# EAGLE design baseboard_rev_01 (EAGLE 6.4)

## Sheet 1 of 3
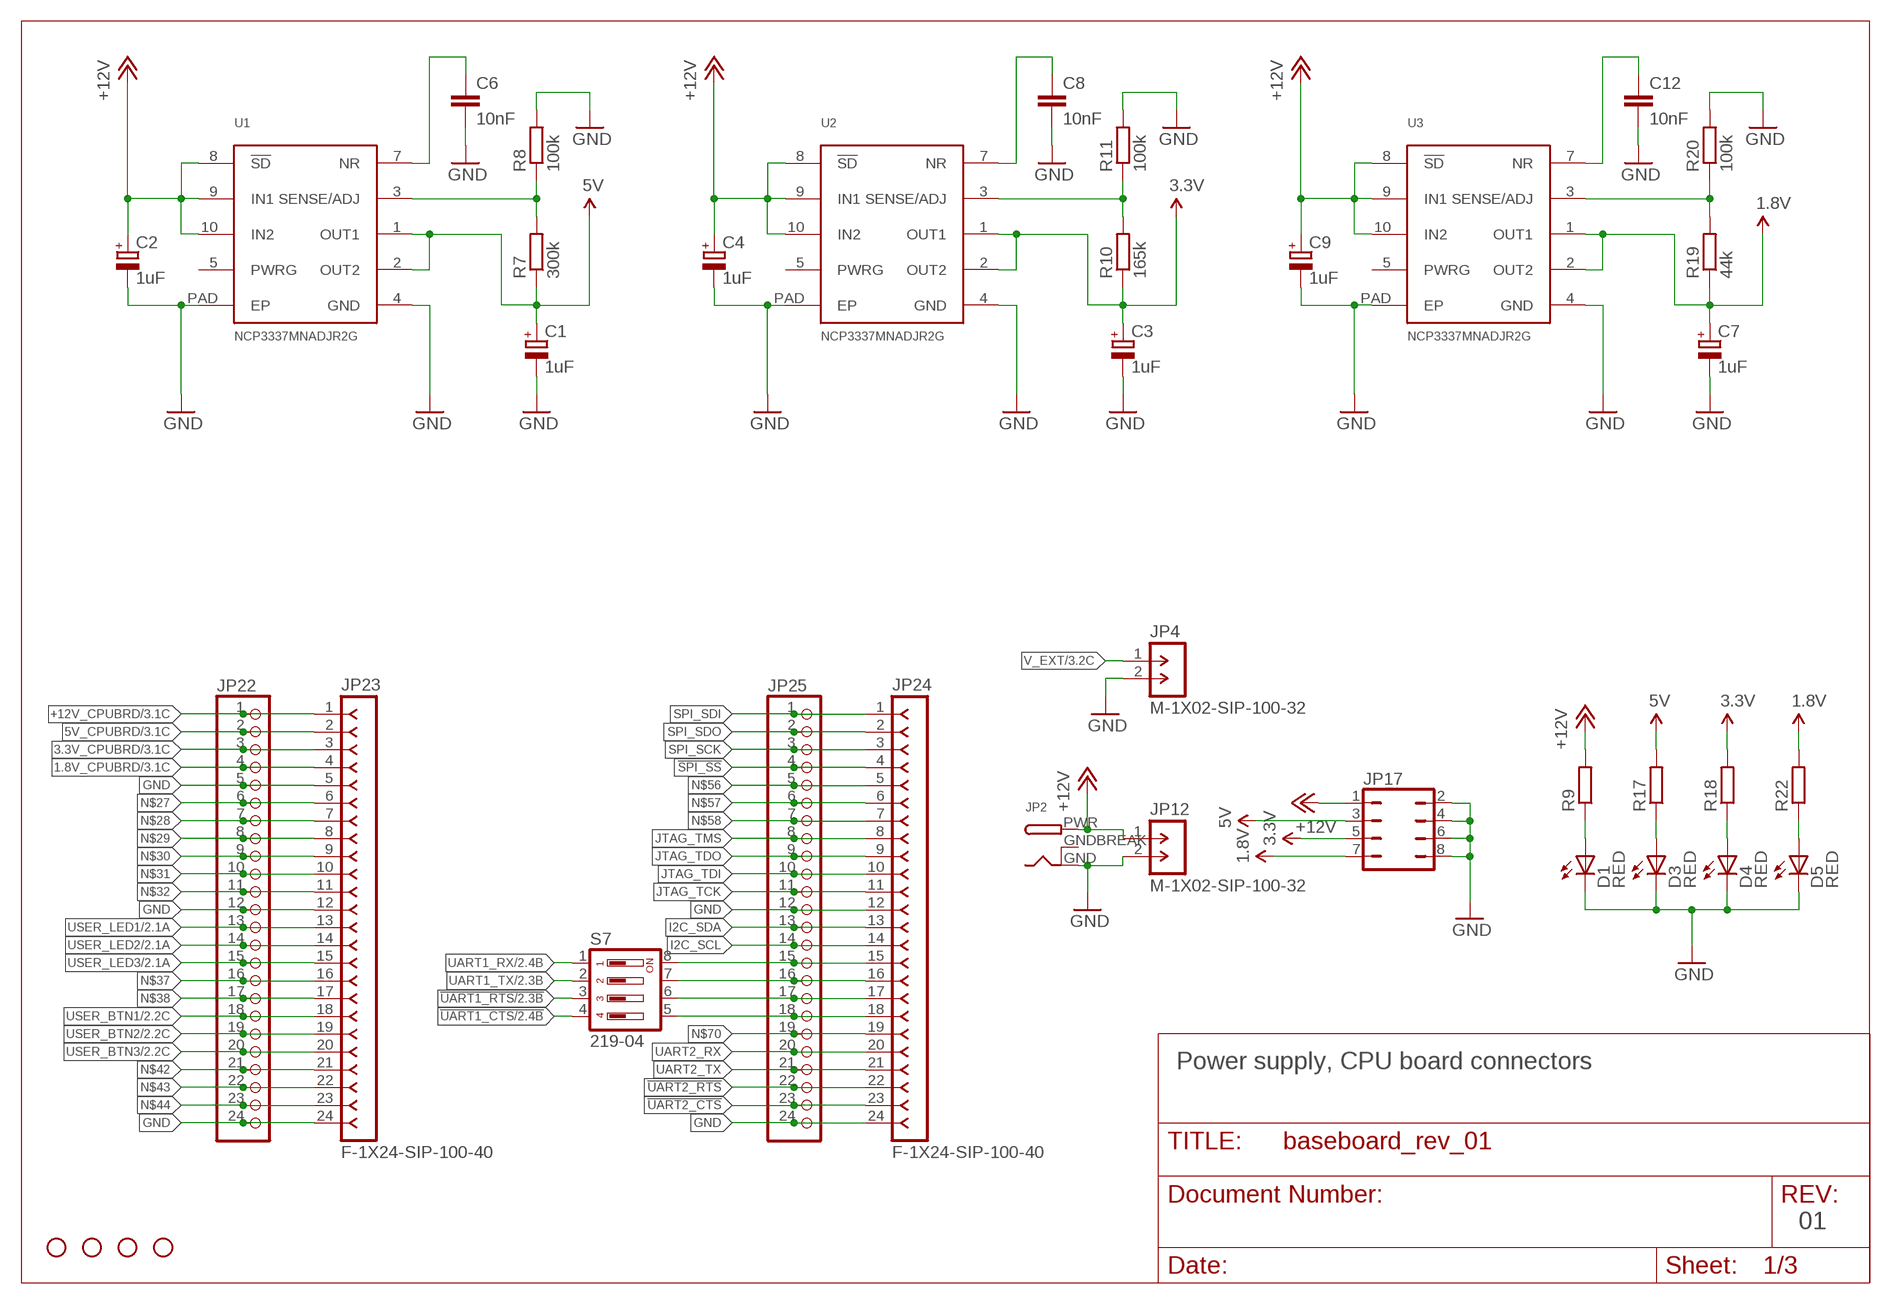
[diagram p0: schematic, sheet 1]

### Parts
C1  1uF  CPOL-EUB  [PANASONIC_B]
C2  1uF  CPOL-EUB  [PANASONIC_B]
C3  1uF  CPOL-EUB  [PANASONIC_B]
C4  1uF  CPOL-EUB  [PANASONIC_B]
C6  10nF  C-EUC0805  [C0805]
C7  1uF  CPOL-EUB  [PANASONIC_B]
C8  10nF  C-EUC0805  [C0805]
C9  1uF  CPOL-EUB  [PANASONIC_B]
C12  10nF  C-EUC0805  [C0805]
D1  RED  LEDCHIPLED_0805  [CHIPLED_0805]
D3  RED  LEDCHIPLED_0805  [CHIPLED_0805]
D4  RED  LEDCHIPLED_0805  [CHIPLED_0805]
D5  RED  LEDCHIPLED_0805  [CHIPLED_0805]
JP1  STAND-OFF  [STAND-OFF]
JP2  DCBARRELPTH  [DCJACK_2MM_PTH]
JP4  M-1X02-SIP-100-32  [SIP-100-02-32]
JP11  STAND-OFF  [STAND-OFF]
JP12  M-1X02-SIP-100-32  [SIP-100-02-32]
JP17  JP4Q  [JP4Q]
JP22  PINHD-1X24  [1X24]
JP23  F-1X24-SIP-100-40  [SIP-100-24-40]
JP24  F-1X24-SIP-100-40  [SIP-100-24-40]
JP25  PINHD-1X24  [1X24]
JP26  STAND-OFF  [STAND-OFF]
JP28  STAND-OFF  [STAND-OFF]
R7  300k  R-EU_R0805  [R0805]
R8  100k  R-EU_R0805  [R0805]
R9  R-EU_R0805  [R0805]
R10  165k  R-EU_R0805  [R0805]
R11  100k  R-EU_R0805  [R0805]
R17  R-EU_R0805  [R0805]
R18  R-EU_R0805  [R0805]
R19  44k  R-EU_R0805  [R0805]
R20  100k  R-EU_R0805  [R0805]
R22  R-EU_R0805  [R0805]
S7  219-04  [CTS-219-04]
U1  NCP3337MNADJR2G  NCP3337  [DFN10]
U2  NCP3337MNADJR2G  NCP3337  [DFN10]
U3  NCP3337MNADJR2G  NCP3337  [DFN10]

### Nets
1.8V: C7.+ JP17.7 R19.1 R22.2 U3.1(OUT1) U3.2(OUT2) ; also sheet 3
1.8V_CPUBRD: JP22.4 JP23.4 ; also sheet 3
3.3V: C3.+ JP17.5 R10.1 R18.2 U2.1(OUT1) U2.2(OUT2) ; also sheet 3
3.3V_CPUBRD: JP22.3 JP23.3 ; also sheet 3
5V: C1.+ JP17.3 R7.1 R17.2 U1.1(OUT1) U1.2(OUT2) ; also sheet 3
5V_CPUBRD: JP22.2 JP23.2 ; also sheet 3
!SPI_SS: JP24.4 JP25.4
!UART1_CTS: S7.4 ; also sheet 2
!UART1_RTS: S7.3 ; also sheet 2
!UART2_CTS: JP24.23 JP25.23
!UART2_RTS: JP24.22 JP25.22
+12V: C2.+ C4.+ C9.+ JP2.PWR JP12.1 JP17.1 R9.2 U1.8(!SD) U1.9(IN1) U1.10(IN2) U2.8(!SD) U2.9(IN1) U2.10(IN2) U3.8(!SD) U3.9(IN1) U3.10(IN2) ; also sheet 2,3
+12V_CPUBRD: JP22.1 JP23.1 ; also sheet 3
GND: C1.- C2.- C3.- C4.- C6.2 C7.- C8.2 C9.- C12.2 D1.C D3.C D4.C D5.C JP2.GND JP4.2 JP12.2 JP17.2 JP17.4 JP17.6 JP17.8 JP22.5 JP22.12 JP22.24 JP23.5 JP23.12 JP23.24 JP24.12 JP24.24 JP25.12 JP25.24 R8.2 R11.2 R20.2 U1.4(GND) U1.PAD(EP) U2.4(GND) U2.PAD(EP) U3.4(GND) U3.PAD(EP) ; also sheet 2,3
I2C_SCL: JP24.14 JP25.14
I2C_SDA: JP24.13 JP25.13
JTAG_TCK: JP24.11 JP25.11
JTAG_TDI: JP24.10 JP25.10
JTAG_TDO: JP24.9 JP25.9
JTAG_TMS: JP24.8 JP25.8
N$11: D4.A R18.1
N$16: D3.A R17.1
N$19: D1.A R9.1
N$24: D5.A R22.1
N$27: JP22.6 JP23.6
N$28: JP22.7 JP23.7
N$29: JP22.8 JP23.8
N$30: JP22.9 JP23.9
N$31: JP22.10 JP23.10
N$32: JP22.11 JP23.11
N$37: JP22.16 JP23.16
N$38: JP22.17 JP23.17
N$42: JP22.21 JP23.21
N$43: JP22.22 JP23.22
N$44: JP22.23 JP23.23
N$51: C8.1 U2.7(NR)
N$56: JP24.5 JP25.5
N$57: JP24.6 JP25.6
N$58: JP24.7 JP25.7
N$66: JP24.15 JP25.15 S7.8
N$67: JP24.16 JP25.16 S7.7
N$68: JP24.17 JP25.17 S7.6
N$69: JP24.18 JP25.18 S7.5
N$70: JP24.19 JP25.19
N$73: R10.2 R11.1 U2.3(SENSE/ADJ)
N$76: C6.1 U1.7(NR)
N$77: R7.2 R8.1 U1.3(SENSE/ADJ)
N$78: C12.1 U3.7(NR)
N$80: R19.2 R20.1 U3.3(SENSE/ADJ)
SPI_SCK: JP24.3 JP25.3
SPI_SDI: JP24.1 JP25.1
SPI_SDO: JP24.2 JP25.2
UART1_RX: S7.1 ; also sheet 2
UART1_TX: S7.2 ; also sheet 2
UART2_RX: JP24.20 JP25.20
UART2_TX: JP24.21 JP25.21
USER_BTN1: JP22.18 JP23.18 ; also sheet 2
USER_BTN2: JP22.19 JP23.19 ; also sheet 2
USER_BTN3: JP22.20 JP23.20 ; also sheet 2
USER_LED1: JP22.13 JP23.13 ; also sheet 2
USER_LED2: JP22.14 JP23.14 ; also sheet 2
USER_LED3: JP22.15 JP23.15 ; also sheet 2
V_EXT: JP4.1 ; also sheet 3
Unconnected: U1.5(PWRG) U2.5(PWRG) U3.5(PWRG)

### Notes on the sheet
- Power supply, CPU board connectors
- 01

## Sheet 2 of 3
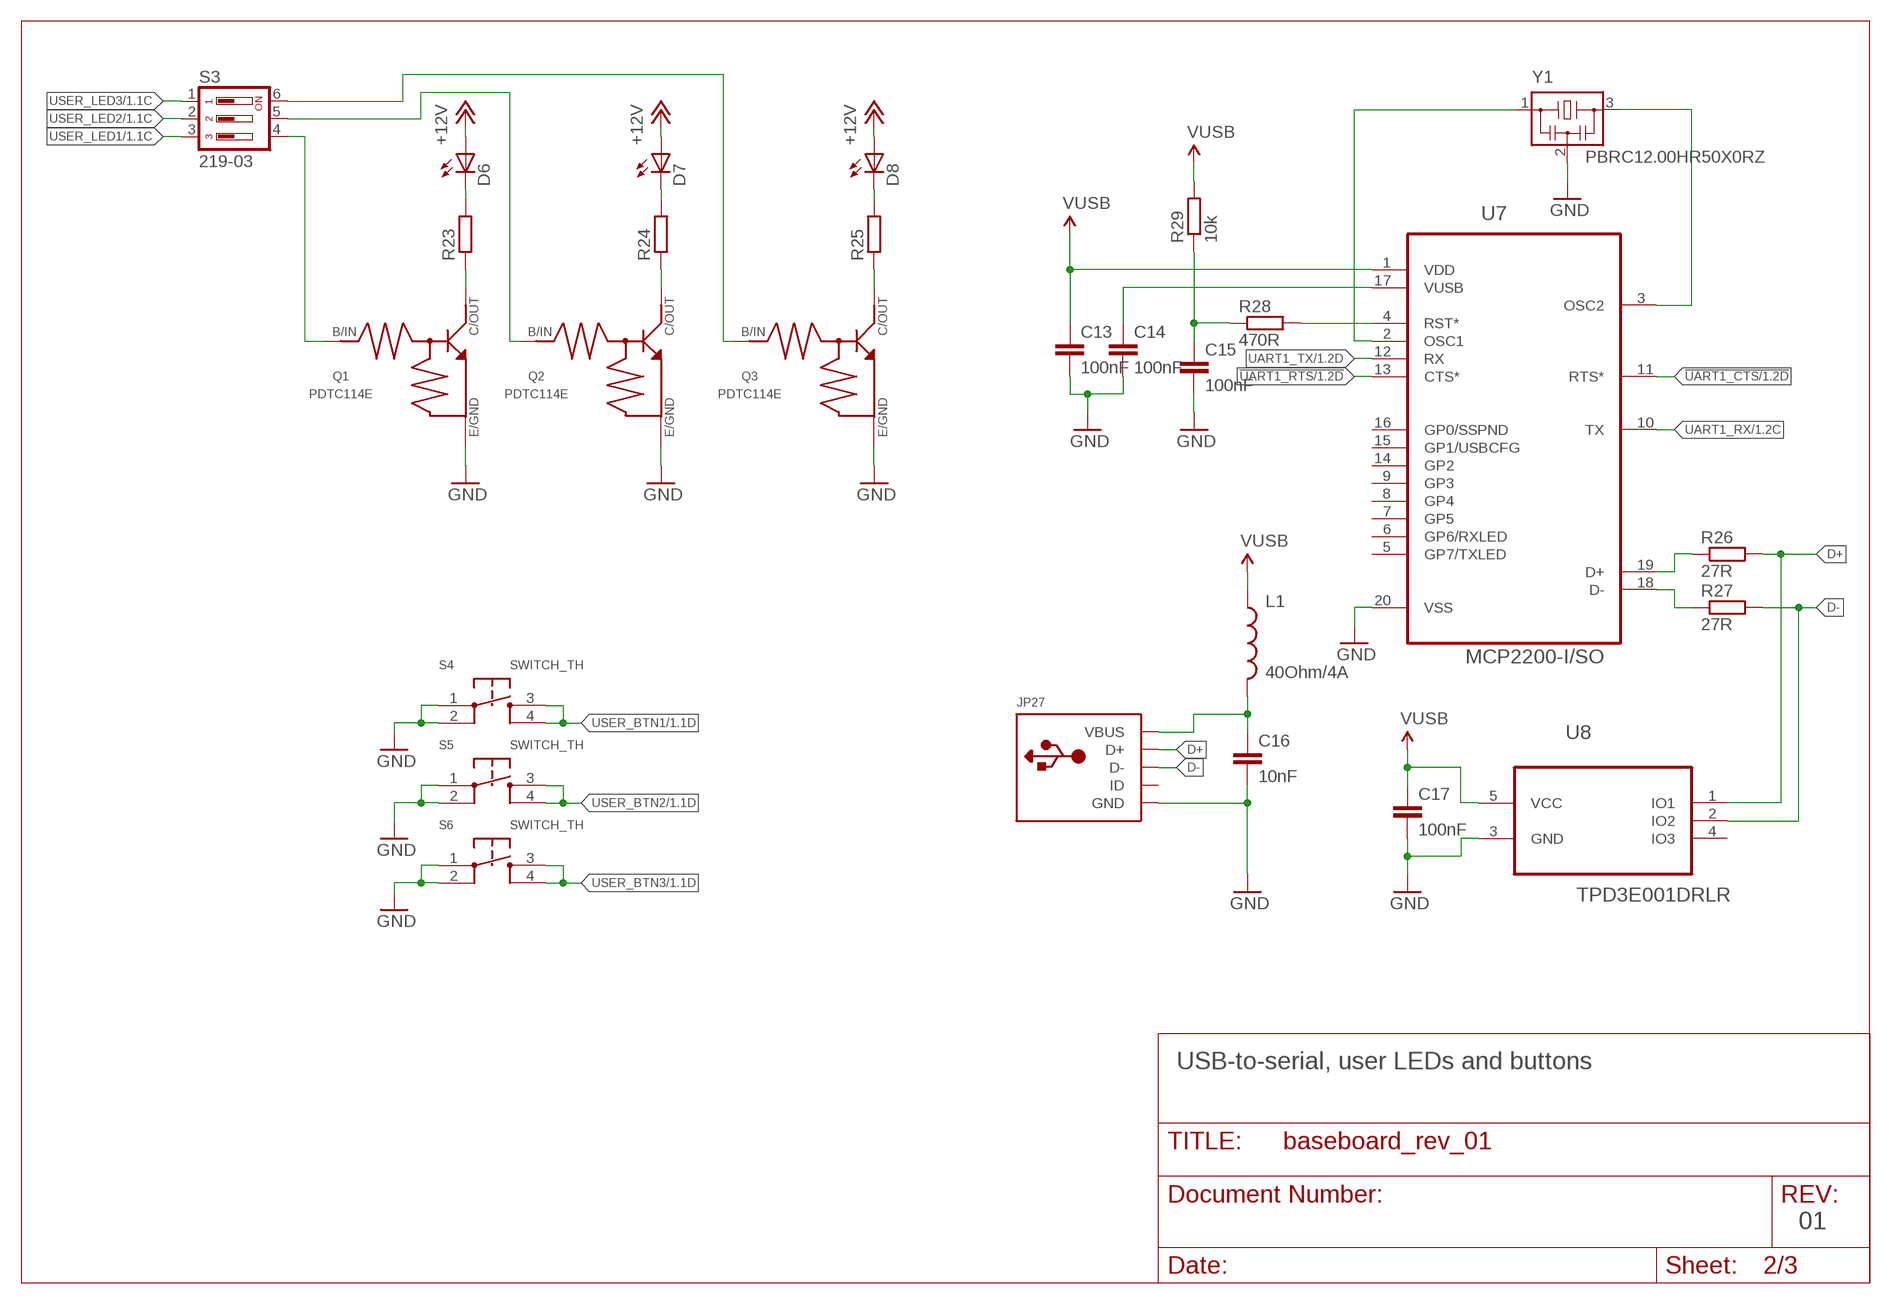
[diagram p1: schematic, sheet 2]

### Parts
C13  100nF  C-EUC0805  [C0805]
C14  100nF  C-EUC0805  [C0805]
C15  100nF  C-EUC0805  [C0805]
C16  10nF  C-EUC0805  [C0805]
C17  100nF  C-EUC0805  [C0805]
D6  LEDCHIPLED_0805  [CHIPLED_0805]
D7  LEDCHIPLED_0805  [CHIPLED_0805]
D8  LEDCHIPLED_0805  [CHIPLED_0805]
JP27  USBMINIB  [USB-MINIB]
L1  40Ohm/4A  INDUCTOR0805  [0805]
Q1  PDTC114E  [SOT416]
Q2  PDTC114E  [SOT416]
Q3  PDTC114E  [SOT416]
R23  R-EU_R0805  [R0805]
R24  R-EU_R0805  [R0805]
R25  R-EU_R0805  [R0805]
R26  27R  R-EU_R0805  [R0805]
R27  27R  R-EU_R0805  [R0805]
R28  470R  R-EU_R0805  [R0805]
R29  10k  R-EU_R0805  [R0805]
S3  219-03  [CTS-219-03]
S4  SWITCH_TH  [SWITCH_TROUGHHOLE]
S5  SWITCH_TH  [SWITCH_TROUGHHOLE]
S6  SWITCH_TH  [SWITCH_TROUGHHOLE]
U7  MCP2200-I/SO  [SOIC127P1034X264-20N]
U8  TPD3E001DRLR  [SOT50P160X60-5N]
Y1  PBRC12.00HR50X0RZ  PBRC-X  [PBRC-H]

### Nets
!UART1_CTS: U7.11(RTS*) ; also sheet 1
!UART1_RTS: U7.13(CTS*) ; also sheet 1
+12V: D6.A D7.A D8.A ; also sheet 1,3
D+: JP27.D+ R26.2 U8.1(IO1)
D-: JP27.D- R27.2 U8.2(IO2)
GND: C13.2 C14.2 C15.2 C16.2 C17.2 JP27.GND Q1.2(E) Q2.2(E) Q3.2(E) S4.1 S4.2 S5.1 S5.2 S6.1 S6.2 U7.20(VSS) U8.3(GND) Y1.2 ; also sheet 1,3
N$14: Q3.1(B) S3.6
N$21: Q2.1(B) S3.5
N$23: Q1.1(B) S3.4
N$33: Q1.3(C) R23.1
N$45: D6.C R23.2
N$46: D7.C R24.2
N$47: D8.C R25.2
N$49: Q2.3(C) R24.1
N$50: Q3.3(C) R25.1
N$52: C16.1 JP27.VBUS L1.2
N$53: C15.1 R28.1 R29.1
N$54: R28.2 U7.4(RST*)
N$55: U7.2(OSC1) Y1.1
N$64: C14.1 U7.17(VUSB)
N$65: U7.3(OSC2) Y1.3
N$71: R26.1 U7.19(D+)
N$72: R27.1 U7.18(D-)
UART1_RX: U7.10(TX) ; also sheet 1
UART1_TX: U7.12(RX) ; also sheet 1
USER_BTN1: S4.3 S4.4 ; also sheet 1
USER_BTN2: S5.3 S5.4 ; also sheet 1
USER_BTN3: S6.3 S6.4 ; also sheet 1
USER_LED1: S3.3 ; also sheet 1
USER_LED2: S3.2 ; also sheet 1
USER_LED3: S3.1 ; also sheet 1
VUSB: C13.1 C17.1 L1.1 R29.2 U7.1(VDD) U8.5(VCC)
Unconnected: JP27.ID U7.5(GP7/TXLED) U7.6(GP6/RXLED) U7.7(GP5) U7.8(GP4) U7.9(GP3) U7.14(GP2) U7.15(GP1/USBCFG) U7.16(GP0/SSPND) U8.4(IO3)

### Notes on the sheet
- USB-to-serial, user LEDs and buttons
- 01

## Sheet 3 of 3
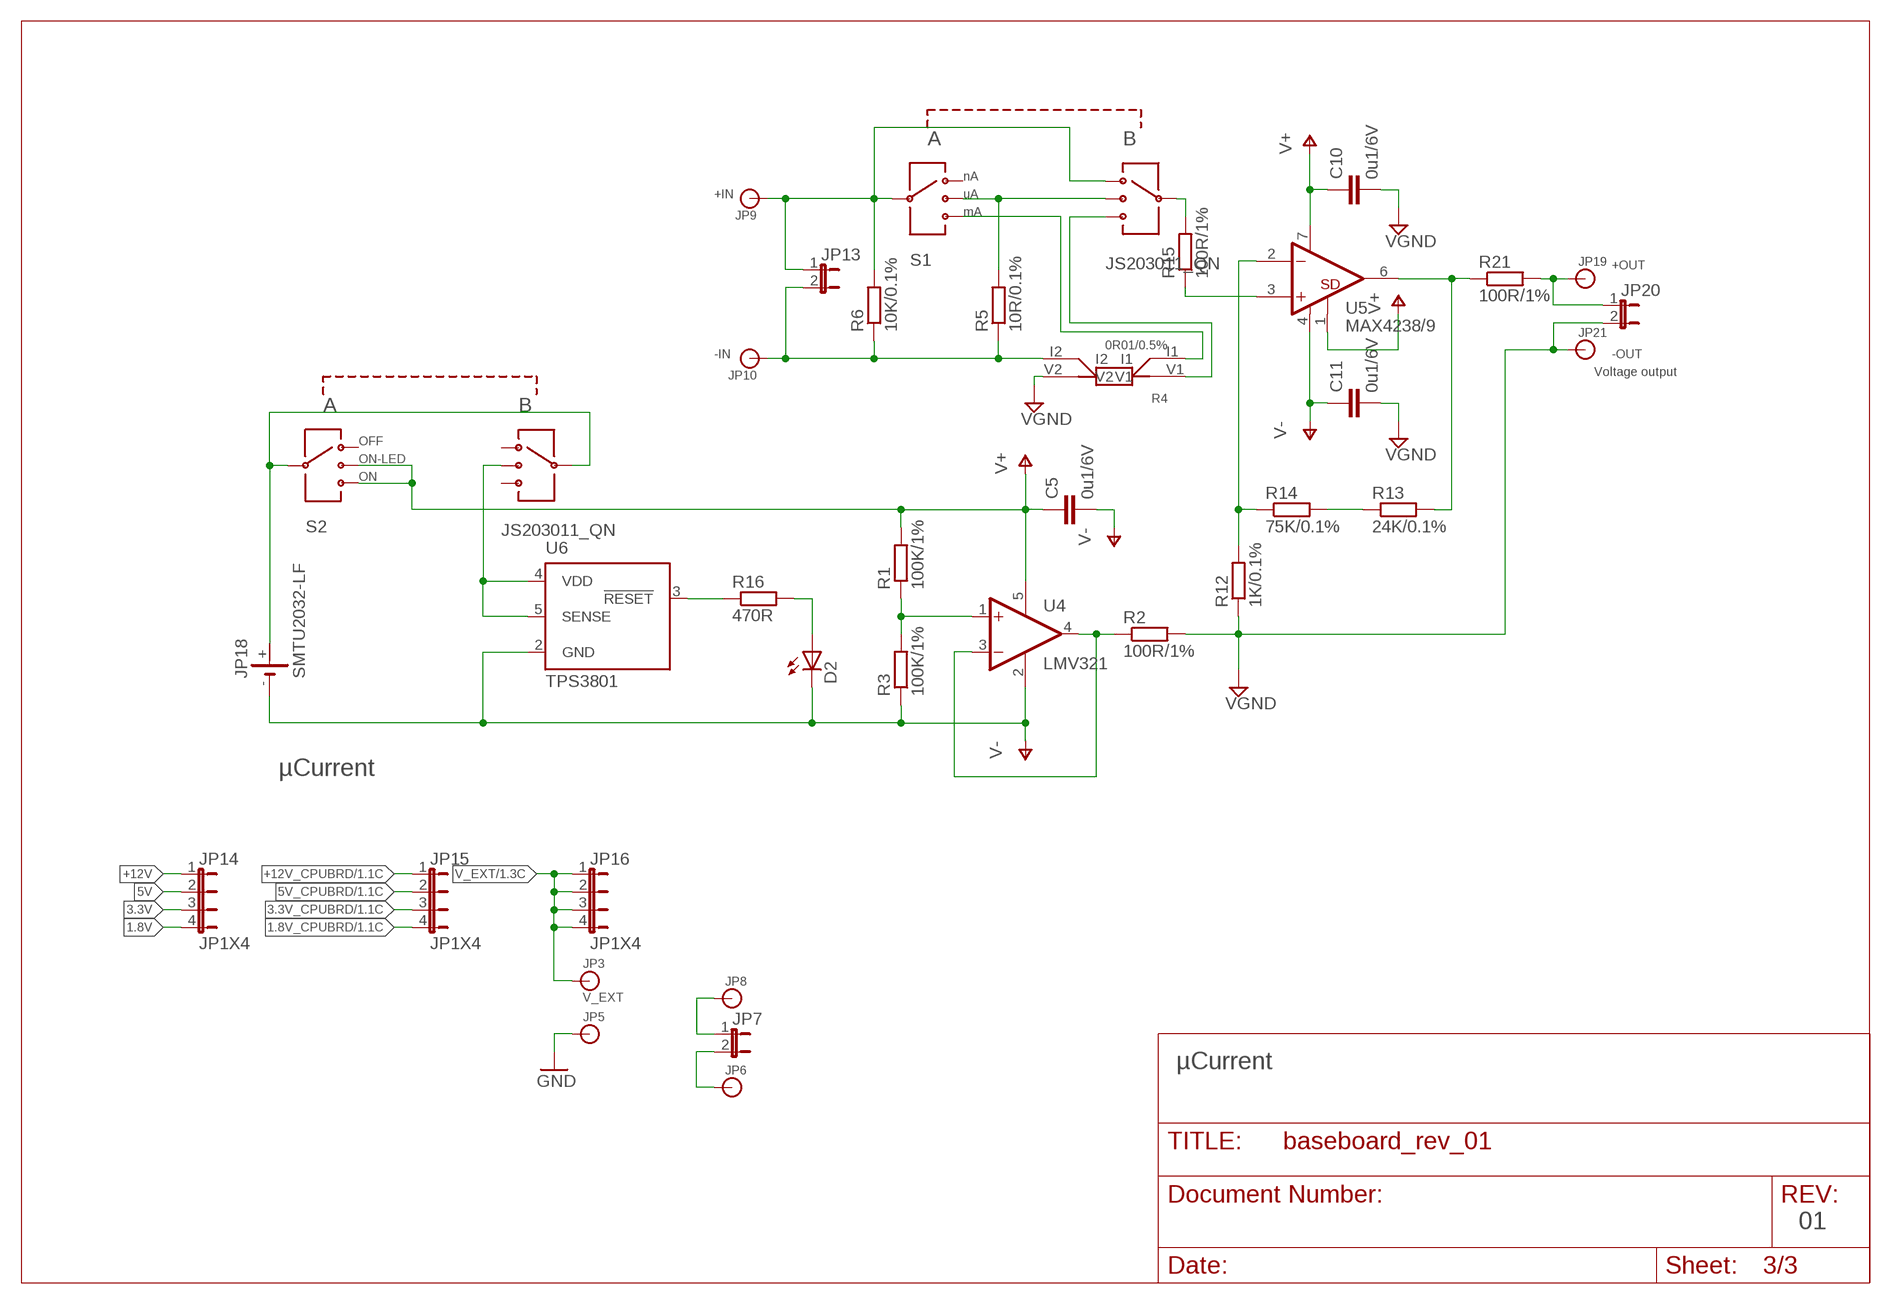
[diagram p2: schematic, sheet 3]

### Parts
C5  0u1/6V  C-EUC0805K  [C0805K]
C10  0u1/6V  C-EUC0805K  [C0805K]
C11  0u1/6V  C-EUC0805K  [C0805K]
D2  LEDCHIPLED_0805  [CHIPLED_0805]
JP3  V_EXT  BANANA_CONN  [BANANA_CONN]
JP5  BANANA_CONN  [BANANA_CONN]
JP6  BANANA_CONN  [BANANA_CONN]
JP7  JUMPER-2PTH  [1X02]
JP8  BANANA_CONN  [BANANA_CONN]
JP9  BANANA_CONN  [BANANA_CONN]
JP10  BANANA_CONN  [BANANA_CONN]
JP13  JUMPER-2PTH  [1X02]
JP14  JP1X4  [JP1X4]
JP15  JP1X4  [JP1X4]
JP16  JP1X4  [JP1X4]
JP18  SMTU2032-LF  [SMTU2032-LF]
JP19  BANANA_CONN  [BANANA_CONN]
JP20  JUMPER-2PTH  [1X02]
JP21  BANANA_CONN  [BANANA_CONN]
R1  100K/1%  R-EU_R0805  [R0805]
R2  100R/1%  R-EU_R0805  [R0805]
R3  100K/1%  R-EU_R0805  [R0805]
R4  0R01/0.5%  LVKXXRXXXXXX  [LVK12RXXXXXX]
R5  10R/0.1%  R-EU_R0805  [R0805]
R6  10K/0.1%  R-EU_R0805  [R0805]
R12  1K/0.1%  R-EU_R0805  [R0805]
R13  24K/0.1%  R-EU_R0805  [R0805]
R14  75K/0.1%  R-EU_R0805  [R0805]
R15  100R/1%  R-EU_R0805  [R0805]
R16  470R  R-EU_R0805  [R0805]
R21  100R/1%  R-EU_R0805  [R0805]
S1  JS203011_QN  [JS203011]
S2  JS203011_QN  [JS203011]
U4  LMV321  LMV321M7  [SC70-5L]
U5  MAX4238/9  [SO08]
U6  TPS3801  TPS3803-01  [DCK]

### Nets
1.8V: JP14.4 ; also sheet 1
1.8V_CPUBRD: JP15.4 ; also sheet 1
3.3V: JP14.3 ; also sheet 1
3.3V_CPUBRD: JP15.3 ; also sheet 1
5V: JP14.2 ; also sheet 1
5V_CPUBRD: JP15.2 ; also sheet 1
+12V: JP14.1 ; also sheet 1,2
+12V_CPUBRD: JP15.1 ; also sheet 1
CURR_INPUT+: JP9.P$1 JP13.1 R6.2 S1.3 S1.5
GND: JP5.P$1 ; also sheet 1,2
N$1: R15.2 S1.7
N$2: R15.1 U5.3(+IN)
N$3: R12.2 R14.1 U5.2(-IN)
N$4: R5.2 S1.2 S1.6
N$5: R13.1 R14.2
N$6: R4.I1 S1.4
N$7: R13.2 R21.1 U5.6(OUT)
N$8: JP19.P$1 JP20.1 R21.2
N$9: JP7.1 JP8.P$1
N$10: JP6.P$1 JP7.2
N$12: R2.1 U4.3(-IN) U4.4(OUT)
N$13: R1.1 R3.2 U4.1(+IN)
N$15: R16.1 U6.3(!RESET)
N$17: S2.6 U6.4(VDD) U6.5(SENSE)
N$18: D2.A R16.2
N$20: JP18.+ S2.3 S2.7
N$22: JP10.P$1 JP13.2 R4.I2 R5.1 R6.1
N$25: R4.V1 S1.8
V+: C5.1 C10.1 R1.2 S2.2 S2.4 U4.5(V+) U5.1(!SHUTDOWN) U5.7(V+)
V-: C5.2 C11.1 D2.C JP18.- R3.1 U4.2(V-) U5.4(V-) U6.2(GND)
V_EXT: JP3.P$1 JP16.1 JP16.2 JP16.3 JP16.4 ; also sheet 1
VGND: C10.2 C11.2 JP20.2 JP21.P$1 R2.2 R4.V2 R12.1
Unconnected: S1.1 S2.1 S2.5 S2.8

### Notes on the sheet
- nA
- +IN | uA
- mA
- +OUT
- -IN | -OUT
- Voltage output
- OFF
- ON-LED
- ON
- µCurrent
- µCurrent
- 01

## Power pins joined to a net without a drawn wire
GNDBREAK: JP2.GNDBREAK

## Library data of the parts
C1-C4 C7 C9 = rcl:CPOL-EU: POLARIZED CAPACITOR, European symbol
C5 C6 C8 C10-C17 = rcl:C-EU: CAPACITOR, European symbol
D1-D8 = adafruit:LED: LED OSRAM: - CHIPLED LG R971, LG N971, LY N971, LG Q971, LY Q971, LO R971, LY R971 LH N974, LH R974 LS Q976, LO Q976, LY Q976 LO Q996 - Hyper CHIPLED LW Q18S LB Q993, LB Q99A, LB R99A - SideLED LS A670, LO A670, LY A670, LG A670, LP A670 LB A673, LV A673, LT A673, LW A673 LH A674 LY A675 LS A676, LA A676, LO A676, LY A676, LW A676 LS A679, LY A679, LG A679 - Hyper Micro SIDELED® LS Y876, LA Y876, LO Y876, LY Y876 LT Y87S - SmartLED LW L88C, LW L88S LB L89C, LB L89S, LG L890 LS L89K, LO L89K, LY L89K LS L896, LA L896, LO L896, LY L896 - TOPLED LS T670, LO T670, LY T670, LG T670, LP T670 LSG T670, LSP T670, LSY T670, LOP T670, LYG T670 LG T671, LOG T671, LSG T671 LB T673, LV T673, LT T673, LW T673 LH T674 LS T676, LA T676, LO T676, LY T676, LB T676, LH T676, LSB T676, LW T676 LB T67C, LV T67C, LT T67C, LS T67K, LO T67K, LY T67K, LW E67C LS E67B, LA E67B, LO E67B, LY E67B, LB E67C, LV E67C, LT E67C LW T67C LS T679, LY T679, LG T679 LS T770, LO T770, LY T770, LG T770, LP T770 LB T773, LV T773, LT T773, LW T773 LH T774 LS E675, LA E675, LY E675, LS T675 LS T776, LA T776, LO T776, LY T776, LB T776 LHGB T686 LT T68C, LB T68C - Hyper Mini TOPLED® LB M676 - Mini TOPLED Santana® LG M470 LS M47K, LO M47K, LY M47K Source: http://www.osram.convergy.de/
JP1 JP11 JP26 JP28 = SparkFun-Electromechanical:STAND-OFF: #4 Stand Off This is the mechanical footprint for a #4 phillips button head screw. Use the keepout ring to avoid running the screw head into surrounding components. SKU : PRT-00447
JP2 = adafruit:DCBARREL: 2.0mm DC Barrel Jack DCJACK_2MM_PTH - Through Hole Jack (4UConnector: 05537)
JP3 JP5 JP6 JP8-JP10 JP19 JP21 = SparkFun-Connectors:BANANA_CONN: Through-hole banana jack
JP4 JP12 = con-headers-jp:M-1X02-: MALE HEADER
JP7 JP13 JP20 = SparkFun-Passives:JUMPER-2: Jumper Basic 0.1" spaced jumper. Use with breakaway headers.
JP14-JP16 = devboard:JP1X4
JP17 = jumper:JP4Q: JUMPER
JP18 = devboard:SMTU2032-LF
JP22 JP25 = pinhead:PINHD-1X24: PIN HEADER
JP23 JP24 = con-headers-jp:F-1X24-: FEMALE HEADER
JP27 = adafruit:USB: USB Connectors USBMINIB - Surface Mount Female Mini-B USB Connector 4UConnector: 06564 By microbuilder.eu Thru-hole RA Female Mini-B USB Connector 4UConnector: 18732 By ladyada.net
L1 = SparkFun:INDUCTOR: Inductors Basic Inductor/Choke - 0603 and 1206. Footprints are not proven and vary greatly between part numbers.
Q1-Q3 = funkfinger:PDTC114E: NXP PDTC114E series http://www.nxp.com/documents/data_sheet/PDTC114E_SER.pdf
R1-R3 R5-R29 = rcl:R-EU_: RESISTOR, European symbol
R4 = devboard:LVKXXRXXXXXX
S1 S2 = devboard:JS203011_QN: JS203011AQN JS203011CQN
S3 = switch-dil:219-03*: Surface Mount DIP Switch Series 219 SMT CTS Electronic Components Sourc: www.ctscorp.com; OC_FARNELL: unknown; OC_NEWARK: unknown
S4-S6 = funkfinger:SWITCH_TH
S7 = switch-dil:219-04*: Surface Mount DIP Switch Series 219 SMT CTS Electronic Components Sourc: www.ctscorp.com; OC_FARNELL: unknown; OC_NEWARK: unknown
U1-U3 = devboard:NCP3337
U4 = linear:LMV321?*: General Purpose, Low Voltage, Rail-to-Rail Output Operational Amplifiers Source: http://www.national.com/mpf/LM/LMV321.html http://www.national.com/dt/lmv_qual.pdf
U5 = devboard:MAX4238/9
U6 = texas:TPS3803: Single Voltage Detector Source: http://focus.ti.com/lit/ds/symlink/tps3803-01.pdf; MF: TEXAS INSTRUMENTS; MPN: TPS3803-01DCKR; OC_FARNELL: 1234719; OC_NEWARK: 77C0392
U7 = devboard:MCP2200-I/SO: USB 2.0 to UART Protocol Converter with GPIO,20SOIC; MPN: MCP2200-I/SO; OC_FARNELL: 1781148; OC_NEWARK: 52R9947; PACKAGE: SOIC-20; SUPPLIER: Microchip
U8 = devboard:TPD3E001DRLR: LOW-CAPACITANCE 3-CHANNEL ±15-kV ESD-PROTECTION ARRAY FOR HIGH-SPEED DATA INTERFACES; MPN: TPD3E001DRLR; OC_FARNELL: 1603422; OC_NEWARK: 41M5842; PACKAGE: SOT-5; SUPPLIER: Texas Instruments
Y1 = funkfinger:PBRC-X

## Board
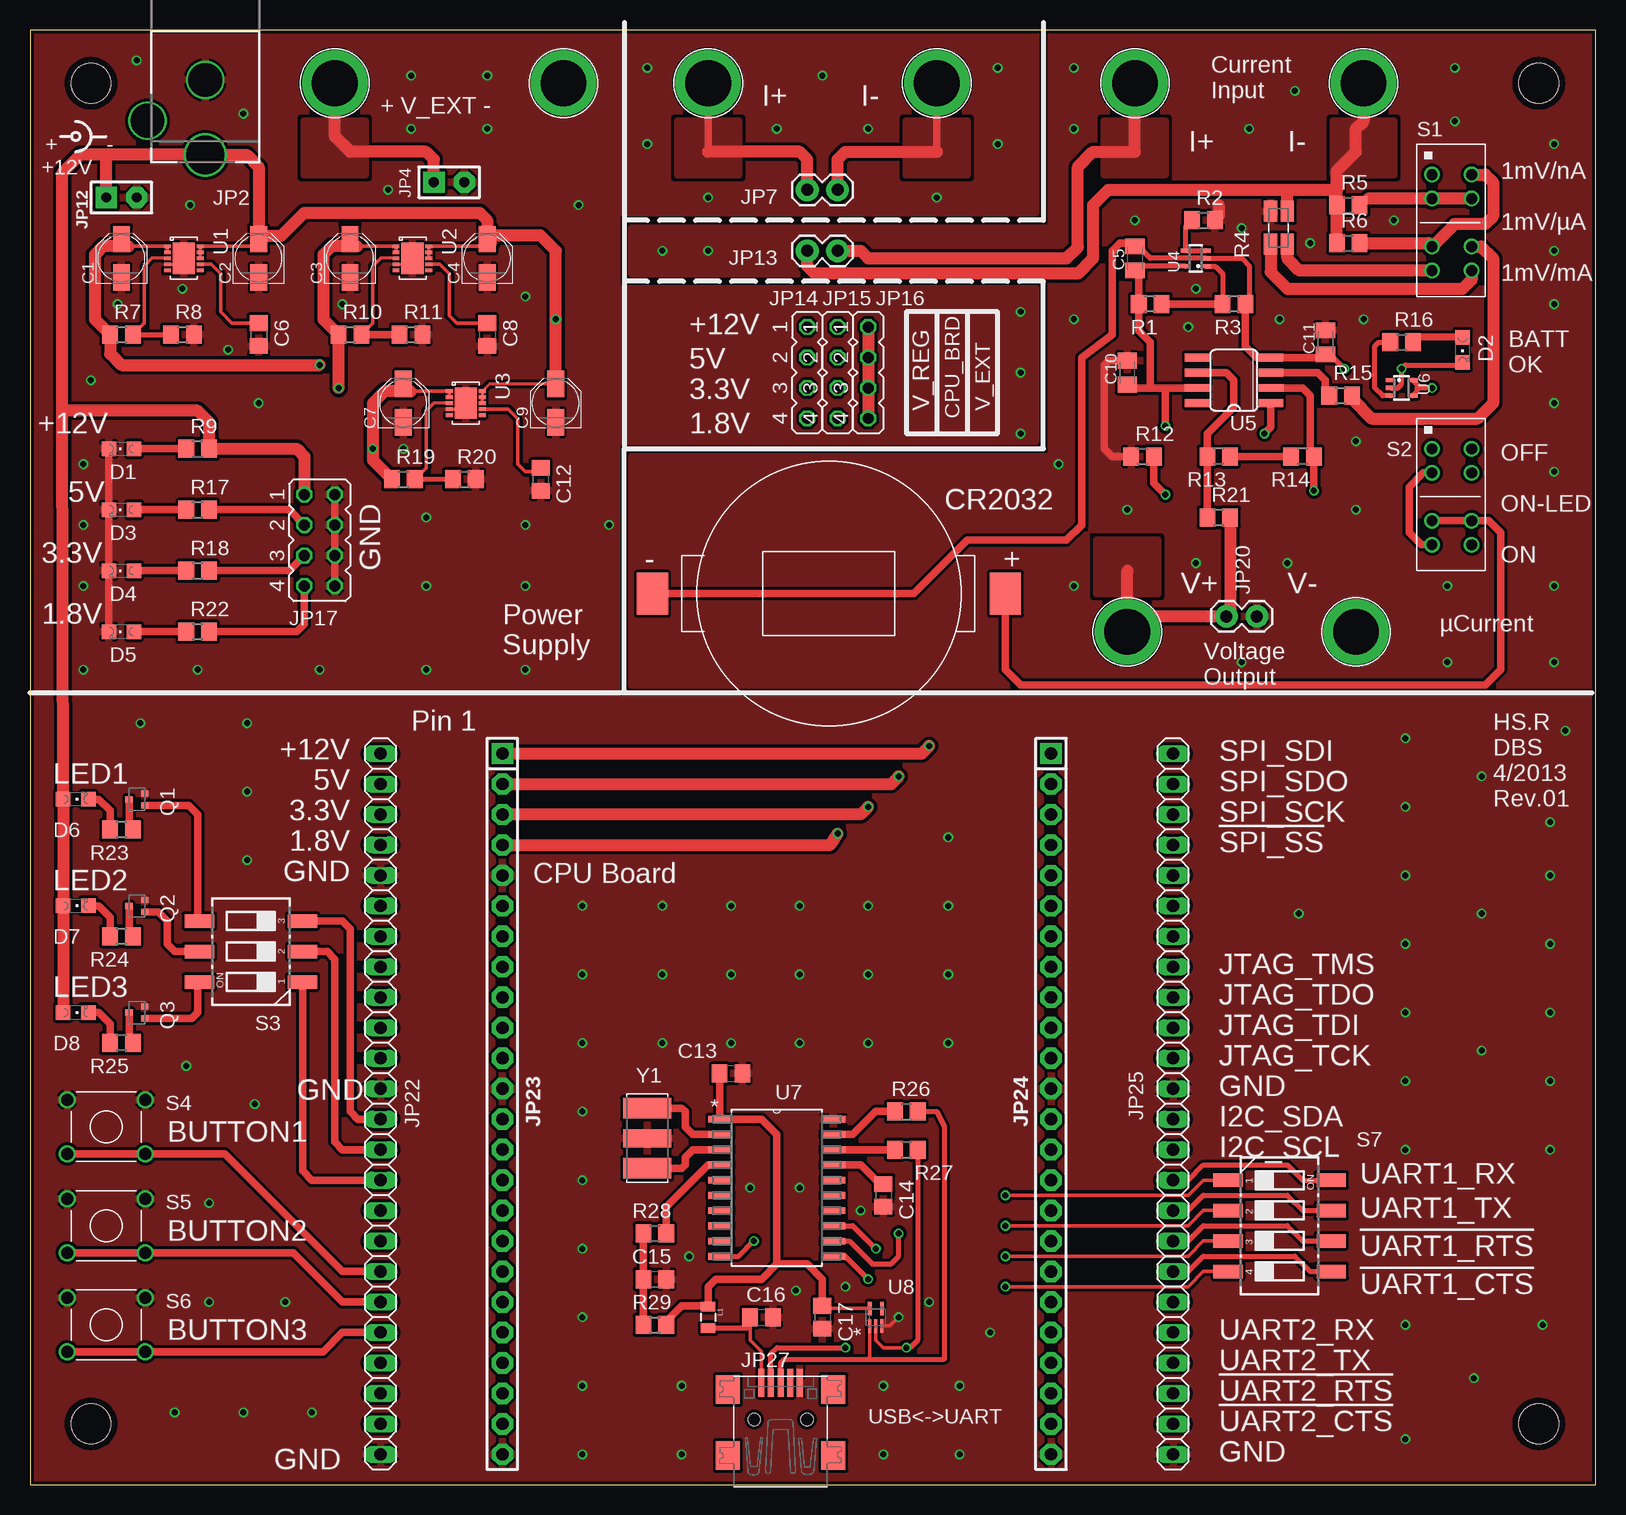
[diagram p3: board, top side]
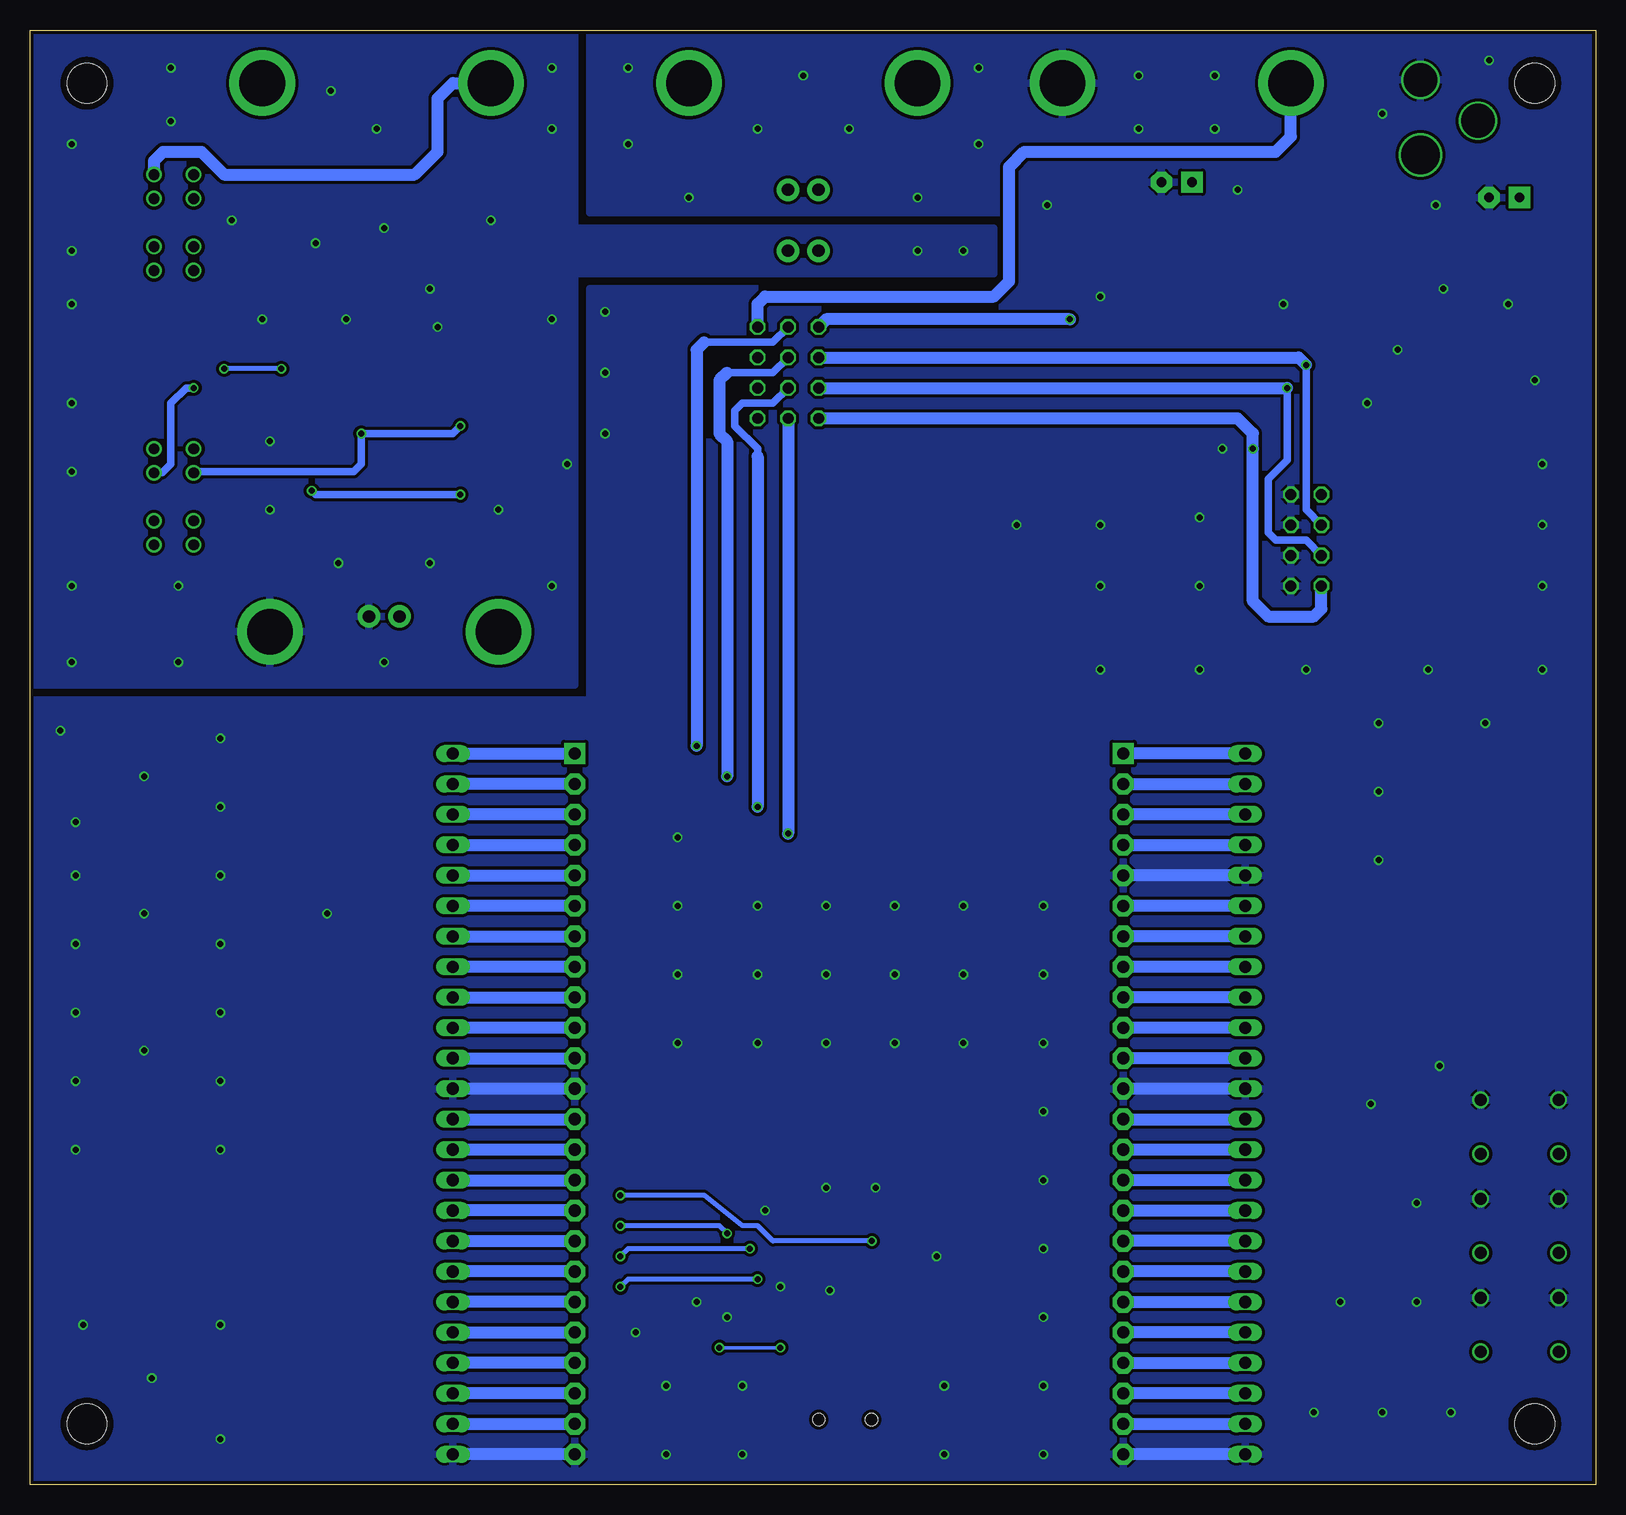
[diagram p4: board, bottom side, seen from below]

Size 130.48 x 121.28 mm. Coordinates in mm from the lower left corner, seen from the top.
Outline: 0,0 130.48,0 130.48,121.28 0,121.28 0,0
Copper layers (1*16): Top 0.035mm / dielectric 1.5mm / Bottom 0.035mm
Design rules "PCB-POOL Standard": minimum track width 0.15mm, minimum drill 0.3mm, track to track 0.15mm, track to pad 0.15mm, pad to pad 0.15mm, via to via 0.15mm, smd to smd 0.15mm, copper to edge 0.3mm, drill to drill 0.2mm, minimum pad ring 0.2mm, minimum via ring 0.15mm, stop-mask expansion 0.075mm, vias tented up to drill 0mil, thermal gap 0.2mm

### Footprints (pad centres in the part's own frame; a part is rotated, then mirrored left to right if it is on the bottom)
PANASONIC_B = smd 2.2 x 1.4: + 1.6,0; - -1.6,0
C0805K = smd 1.3 x 1.6: 1 -1,0; 2 1,0
C0805 = smd 1.3 x 1.5: 1 -0.95,0; 2 0.95,0
CHIPLED_0805 = smd 1.2 x 1.2: A 0,-1.05; C 0,1.05
STAND-OFF = hole 3.302: 0,0
DCJACK_2MM_PTH = drill 2.8: GND 0,7.35; GNDBREAK 4.8,10.75 | drill 3.2: PWR 0,13.6
BANANA_CONN = drill 3.81 pad 5.461: P$1 0,0
SIP-100-02-32 = drill 0.813 pad 1.778 square: 1 -1.27,0 | drill 0.813 pad 1.778 octagon: 2 1.27,0
1X02 = drill 1.016 pad 1.88: 1 0,0; 2 2.54,0
JP1X4 = drill 0.914 octagon: 1 -3.81,0; 2 -1.27,0; 3 1.27,0; 4 3.81,0
JP4Q = drill 0.914 octagon: 1 -3.81,-1.27; 2 -3.81,1.27; 3 -1.27,-1.27; 4 -1.27,1.27; 5 1.27,-1.27; 6 1.27,1.27; 7 3.81,-1.27; 8 3.81,1.27
SMTU2032-LF = smd 2.6 x 3.5: + -14.605,0; - 14.795,0
1X24 = drill 1.016 long: 1 -29.21,0; 2 -26.67,0; 3 -24.13,0; 4 -21.59,0; 5 -19.05,0; 6 -16.51,0; 7 -13.97,0; 8 -11.43,0; 9 -8.89,0; 10 -6.35,0; 11 -3.81,0; 12 -1.27,0; 13 1.27,0; 14 3.81,0; 15 6.35,0; 16 8.89,0; 17 11.43,0; 18 13.97,0; 19 16.51,0; 20 19.05,0; 21 21.59,0; 22 24.13,0; 23 26.67,0; 24 29.21,0
SIP-100-24-40 = drill 1.016 pad 1.778 square: 1 -29.21,0 | drill 1.016 pad 1.778 octagon: 2 -26.67,0; 3 -24.13,0; 4 -21.59,0; 5 -19.05,0; 6 -16.51,0; 7 -13.97,0; 8 -11.43,0; 9 -8.89,0; 10 -6.35,0; 11 -3.81,0; 12 -1.27,0; 13 1.27,0; 14 3.81,0; 15 6.35,0; 16 8.89,0; 17 11.43,0; 18 13.97,0; 19 16.51,0; 20 19.05,0; 21 21.59,0; 22 24.13,0; 23 26.67,0; 24 29.21,0
USB-MINIB = smd 0.5 x 2.308: D+ 0,4.064; D- -0.8,4.064; GND 1.6,4.064; ID 0.8,4.064; VBUS -1.6,4.064 | smd 2 x 2.4: GND1 -4.4,-2; GND2 -4.4,3.5; GND3 4.4,3.5; GND4 4.4,-2 | hole 1: -2.2,1; 2.2,1
0805 = smd 0.8 x 1.2: 1 -0.9,0; 2 0.9,0
SOT416 = smd 0.6 x 0.5: 1 0.66,-0.51; 2 0.66,0.49; 3 -0.64,-0.01
R0805 = smd 1.3 x 1.5: 1 -0.95,0; 2 0.95,0
LVK12RXXXXXX = smd 1.75 x 1.1: I1 -1.37,-0.635; I2 1.38,-0.635; V1 -1.37,0.765; V2 1.38,0.765
JS203011 = drill 0.9: 1 -3.81,-1.27; 2 -1.81,-1.27; 3 2.19,-1.27; 4 4.19,-1.27; 5 -3.81,2.03; 6 -1.81,2.03; 7 2.19,2.03; 8 4.19,2.03
CTS-219-03 = smd 1.13 x 2.44: 1 -2.54,-4.3; 2 0,-4.3; 3 2.54,-4.3; 4 2.54,4.3; 5 0,4.3; 6 -2.54,4.3
SWITCH_TROUGHHOLE = drill 1: 1 -3.25,2.25; 2 3.25,2.25; 3 -3.25,-2.25; 4 3.25,-2.25
CTS-219-04 = smd 1.13 x 2.44: 1 -3.81,-4.3; 2 -1.27,-4.3; 3 1.27,-4.3; 4 3.81,-4.3; 5 3.81,4.3; 6 1.27,4.3; 7 -1.27,4.3; 8 -3.81,4.3
DFN10 = smd 0.301 x 0.565: 1 -1,-1.25; 2 -0.5,-1.25; 3 0,-1.25; 4 0.5,-1.25; 5 1,-1.25; 6 1,1.49; 7 0.5,1.49; 8 0,1.49; 9 -0.5,1.49; 10 -1,1.49 | smd 2.602 x 1.851: PAD 0,0.12
SC70-5L = smd 0.35 x 0.8: 1 -0.65,-0.85; 2 0,-0.85; 3 0.65,-0.85; 4 0.65,0.85; 5 -0.65,0.85
SO08 = smd 0.66 x 2.032: 1 -1.905,-3.073; 2 -0.635,-3.073; 3 0.635,-3.073; 4 1.905,-3.073; 5 1.905,3.073; 6 0.635,3.073; 7 -0.635,3.073; 8 -1.905,3.073
DCK = smd 0.35 x 0.8: 1 -0.65,-0.925; 2 0,-0.925; 3 0.65,-0.925; 4 0.65,0.925; 5 -0.65,0.925
SOIC127P1034X264-20N = smd 1.981 x 0.559: 1 -4.699,5.715; 2 -4.699,4.445; 3 -4.699,3.175; 4 -4.699,1.905; 5 -4.699,0.635; 6 -4.699,-0.635; 7 -4.699,-1.905; 8 -4.699,-3.175; 9 -4.699,-4.445; 10 -4.699,-5.715; 11 4.699,-5.715; 12 4.699,-4.445; 13 4.699,-3.175; 14 4.699,-1.905; 15 4.699,-0.635; 16 4.699,0.635; 17 4.699,1.905; 18 4.699,3.175; 19 4.699,4.445; 20 4.699,5.715
SOT50P160X60-5N = smd 1.118 x 0.254: 1 -0.737,0.508; 2 -0.737,0; 3 -0.737,-0.508 | smd 1.118 x 0.305: 4 0.737,-0.508; 5 0.737,0.508
PBRC-H = smd 1.7 x 4: 1 -2.5,0; 3 2.5,0 | smd 1.5 x 4: 2 0,0

### Placement (x,y rotation side)
C1  7.62,102.23 90 top
C2  19.05,102.23 90 top
C3  26.67,102.23 90 top
C4  38.1,102.23 90 top
C5  92.08,102.23 90 top
C6  19.05,95.89 270 top
C7  31.11,90.17 90 top
C8  38.1,95.89 270 top
C9  43.81,90.17 90 top
C10  91.44,92.71 90 top
C11  107.95,95.25 90 top
C12  42.55,83.82 270 top
C13  58.42,34.29 0 top
C14  71.12,24.13 270 top
C15  52.07,17.14 0 top
C16  60.96,13.97 0 top
C17  66.04,13.97 270 top
D1  7.62,86.36 90 top
D2  119.38,94.61 180 top
D3  7.62,81.28 90 top
D4  7.62,76.2 90 top
D5  7.62,71.12 90 top
D6  3.81,57.15 270 top
D7  3.81,48.26 270 top
D8  3.81,39.37 270 top
JP1  5.08,116.84 0 top
JP2  14.61,124.46 180 top
JP3  25.4,116.84 0 top
JP4  34.92,108.58 0 top
JP5  44.45,116.84 0 top
JP6  56.52,116.84 270 top
JP7  67.31,107.95 180 top
JP8  75.56,116.84 270 top
JP9  92.08,116.84 0 top
JP10  111.12,116.84 0 top
JP11  125.73,116.84 0 top
JP12  7.62,107.31 0 top
JP13  67.31,102.87 180 top
JP14  64.77,92.71 270 top
JP15  67.31,92.71 270 top
JP16  69.85,92.71 270 top
JP17  24.13,78.74 270 top
JP18  66.67,74.3 180 top
JP19  91.44,71.12 0 top
JP20  99.69,72.39 0 top
JP21  110.49,71.12 0 top
JP22  29.21,31.75 270 top
JP23  39.37,31.75 270 top
JP24  85.09,31.75 270 top
JP25  95.25,31.75 270 top
JP26  5.08,5.08 0 top
JP27  62.55,4.45 0 top
JP28  125.73,5.08 0 top
L1  56.52,13.97 270 top
Q1  8.89,57.15 0 top
Q2  8.89,48.26 0 top
Q3  8.89,39.37 0 top
R1  93.34,98.42 180 top
R2  97.79,105.41 0 top
R3  100.33,98.42 180 top
R4  104.14,104.78 90 top
R5  109.86,106.68 0 top
R6  109.86,103.5 0 top
R7  7.62,95.89 0 top
R8  12.7,95.89 0 top
R9  13.97,86.36 0 top
R10  26.67,95.89 0 top
R11  31.75,95.89 0 top
R12  92.71,85.72 0 top
R13  99.06,85.72 180 top
R14  106.05,85.72 180 top
R15  109.22,90.81 0 top
R16  114.3,95.25 0 top
R17  13.97,81.28 0 top
R18  13.97,76.2 0 top
R19  31.11,83.82 0 top
R20  36.2,83.82 0 top
R21  99.06,80.64 0 top
R22  13.97,71.12 0 top
R23  7.62,54.61 180 top
R24  7.62,45.72 180 top
R25  7.62,36.83 180 top
R26  73.03,31.11 0 top
R27  73.03,27.94 0 top
R28  52.07,20.95 0 top
R29  52.07,13.34 0 top
S1  118.11,105.41 270 top
S2  118.11,82.55 270 top
S3  18.41,44.45 90 top
S4  6.35,29.84 0 top
S5  6.35,21.59 0 top
S6  6.35,13.34 0 top
S7  104.14,21.59 270 top
U1  12.7,102.23 270 top
U2  31.75,102.23 270 top
U3  36.2,90.17 270 top
U4  97.16,102.23 90 top
U5  100.33,92.08 90 top
U6  114.3,91.44 270 top
U7  62.23,24.77 0 top
U8  70.48,13.97 90 top
Y1  51.44,28.89 270 top

### Tracks (layer width: path | path; a pad name or v marks a point on that pad's centre or on a via)
1.8V  (via drill 0.5)
  Top 0.305: 31.71,91.17 U3.1 U3.2
  Top 0.406: 31.71,91.17 C7.+
  Top 0.61: R22.2 22.23,71.12 22.86,71.75 JP17.7 | 29.84,83.5 R19.1
  Top 1.016: 31.71,91.17 29.57,91.17 28.57,90.17 v28.57,86.36 28.57,85.41 R19.1
  Bottom 1.016: JP14.4 29.84,88.9 28.57,87.63 v28.57,86.36 28.57,73.66 27.3,72.39 23.5,72.39 22.86,73.03 JP17.7
1.8V_CPUBRD  (via drill 0.5)
  Top 1.016: JP23.4 66.67,53.34 v67.31,54.29
  Bottom 1.016: JP23.4 JP22.4 | JP15.4 v67.31,54.29
3.3V  (via drill 0.5)
  Top 0.305: C3.+ 27.27,103.23 U2.1 U2.2
  Top 0.61: R18.2 21.59,76.2 JP17.5 | R10.1
  Top 1.016: 27.27,103.23 25.13,103.23 24.45,102.55 24.45,97.16 R10.1 | v25.72,91.44 R10.1
  Bottom 0.61: JP17.5 24.13,78.74 26.67,78.74 27.3,79.38 27.3,83.82 25.72,85.41 v25.72,91.44
  Bottom 1.016: JP14.3 v25.72,91.44
3.3V_CPUBRD  (via drill 0.5)
  Top 1.016: v69.85,56.52 69.22,55.88 JP23.3
  Bottom 0.61: JP15.3 68.58,90.17 71.12,90.17 71.75,89.53 71.75,88.27 69.85,86.36 69.85,85.72
  Bottom 1.016: JP22.3 JP23.3 | 69.85,85.72 v69.85,56.52
5V  (via drill 0.5)
  Top 0.305: C1.+ 8.22,103.23 U1.1 U1.2
  Top 0.61: R17.2 21.59,81.28 JP17.3
  Top 1.016: 8.22,103.23 6.08,103.23 5.4,102.55 5.4,97.16 R7.1 6.67,94.3 7.62,93.34 v24.13,93.34
  Bottom 0.61: v24.13,93.34 24.13,81.28 JP17.3
  Bottom 1.016: JP14.2 24.77,93.98 v24.13,93.34
5V_CPUBRD  (via drill 0.5)
  Top 1.016: JP23.2 71.75,58.42 v72.39,59.05
  Bottom 0.61: JP15.2 68.58,92.71 72.39,92.71
  Bottom 1.016: JP23.2 JP22.2 | v72.39,59.05 72.39,87 73.03,87.63 73.03,92.08 72.39,92.71
!SPI_SS
  Bottom 1.016: JP25.4 JP24.4
!UART1_CTS  (via drill 0.5)
  Top 0.305: S7.4 97.79,17.78 96.52,16.51 v81.28,16.51
  Top 0.406: U7.11 67.94,19.05 v69.85,17.14
  Bottom 0.406: v69.85,17.14 80.64,17.14 v81.28,16.51
!UART1_RTS  (via drill 0.5)
  Top 0.305: S7.3 97.79,20.32 96.52,19.05 v81.28,19.05
  Top 0.406: U7.13 68.58,21.59 v70.48,19.68
  Bottom 0.406: v70.48,19.68 80.64,19.68 v81.28,19.05
!UART2_CTS
  Bottom 1.016: JP25.23 JP24.23
!UART2_RTS
  Bottom 1.016: JP24.22 JP25.22
+12V  (via drill 0.5)
  Top 0.254: U3.9 U3.10 38.28,91.77 C9.+
  Top 0.305: U3.9 U3.8 | C2.+ 18.45,103.23 U1.10 U1.9 U1.8 | C4.+ 37.5,103.23 U2.10 U2.9 U2.8
  Top 1.016: JP17.1 22.86,85.72 22.23,86.36 R9.2 14.92,88.58 13.97,89.53 2.69,89.53 | D8.A D7.A D6.A 2.69,89.53 | 2.69,89.53 2.69,109.38 4.18,110.86 6.35,110.86 | 38.43,103.5 C4.+ | 6.35,110.86 JP2.PWR 18.05,110.86 19.05,109.86 19.05,104.14 | C4.+ 38.1,105.41 37.47,106.05 22.86,106.05 20.95,104.14 19.05,104.14 | 19.05,104.14 C2.+ | C9.+ v43.81,97.16 43.81,102.87 42.55,104.14 38.41,104.14 C4.+ | JP12.1 6.35,110.86
  Bottom 1.016: v43.81,97.16 64.14,97.16 JP14.1
+12V_CPUBRD  (via drill 0.5)
  Top 1.016: JP23.1 74.3,60.96 v74.93,61.59
  Bottom 0.61: JP15.1 68.58,95.25 74.3,95.25
  Bottom 1.016: JP22.1 JP23.1 | v74.93,61.59 74.93,94.61 74.3,95.25
CURR_INPUT+
  Top 1.016: R6.2 116.56,103.5 S1.3 118.71,105.09 121.28,105.09 121.92,105.73 121.92,108.58 121.28,109.22 S1.5 | JP13.1 69.22,102.87 69.85,102.23 86.36,102.23 87.31,103.19 87.31,109.86 88.58,111.12 92.08,111.12 JP9.P$1
  Bottom 1.016: S1.5 120.14,110.36 119.38,111.12 116.2,111.12 114.3,109.22 98.42,109.22 96.52,111.12 96.52,115.57 95.25,116.84 JP9.P$1
  pour Top (isolate 0.406): 89.53,109.22 94.61,109.22 94.61,113.67 89.53,113.67
D+
  Top 0.305: U8.1 69.98,10.6 69.85,10.48
  Top 0.406: JP27.D+ 62.55,10.16 62.87,10.48 69.85,10.48 76.2,10.48 76.2,29.84 75.56,31.11 R26.2
D-  (via drill 0.5)
  Top 0.305: U8.2 70.48,12.06 71.12,11.43 v73.03,11.43 73.34,11.43
  Top 0.406: JP27.D- 61.75,10.95 62.23,11.43 v67.94,11.43 | R27.2 73.97,12.06 73.34,11.43
  Bottom 0.305: v67.94,11.43 v73.03,11.43
GND  (via drill 0.5)
  Top 0.254: U1.4 12.32,101.73 | U2.4 31.37,101.73 | U3.4 35.81,89.67
  Top 0.305: U8.3 71.65,13.23 v72.39,13.97
  Top 0.406: 12.32,101.73 U1.PAD | 31.37,101.73 U2.PAD | 35.81,89.67 U3.PAD
  Top 0.61: D1.C D3.C D4.C D5.C | JP17.2 JP17.4 JP17.6 JP17.8
  Bottom 1.016: JP24.24 JP25.24 | JP24.12 JP25.12 | JP22.5 JP23.5 | JP22.12 JP23.12 | JP22.24 JP23.24
  other vias: 17.78,114.3 12.7,99.69 29.84,107.95 26.04,98.42 45.72,106.68 38.1,117.47 41.27,99.06 19.05,90.17 5.08,92.08 4.45,85.09 4.45,80.01 4.45,74.93 4.45,67.94 13.97,67.94 24.13,67.94 54.93,19.05 60.01,24.77 64.14,24.77 54.29,2.54 54.29,8.26 46.04,2.54 46.04,8.26 46.04,13.97 46.04,19.68 69.22,22.86 63.82,16.19 74.93,15.24 80.01,12.7 67.94,16.51 71.12,8.26 71.12,2.54 77.47,8.26 77.47,2.54 46.04,25.4 46.04,31.11 46.04,36.83 46.04,42.55 33.02,67.94 33.02,74.93 41.27,74.93 41.27,67.94 33.02,80.64 31.11,86.36 38.1,113.03 51.44,111.76 56.52,107.31 62.23,113.03 66.04,117.47 69.85,113.03 75.56,107.31 80.64,111.76 46.04,48.26 18.1,52.07 18.1,57.78 18.1,63.5 69.85,48.26 64.14,48.26 58.42,48.26 52.7,48.26 69.85,42.55 64.14,42.55 58.42,42.55 52.7,42.55 69.85,36.83 64.14,36.83 58.42,36.83 52.7,36.83 76.52,36.83 76.52,42.55 76.52,48.26 76.52,53.98 114.62,27.94 114.62,33.66 114.62,39.37 114.62,45.09 114.62,50.8 114.62,56.52 114.62,62.23 114.62,13.34 114.62,3.81 126.05,13.34 120.33,8.89 126.68,27.94 126.68,33.66 126.68,39.37 126.68,45.09 126.68,50.8 126.68,55.24 127.95,62.87 23.5,6.03 17.78,6.03 12.06,6.03 13.34,106.68 8.89,118.75 31.75,117.47 31.75,113.03 7.3,98.42 82.55,97.79 82.55,92.71 82.55,87.63 80.64,118.11 51.44,118.11 120.97,59.05 120.97,47.62 120.97,36.2 105.73,47.62 9.21,63.5 13.02,34.92 18.73,31.75 14.92,23.5 14.92,15.24 21.27,15.24 16.51,94.61 41.27,80.01 48.26,80.01
  pour Top (isolate 0.254, rank 2): 83.82,121.28 0.64,121.28 0.64,0 130.18,0 130.18,65.41 48.9,65.41 48.9,87 83.82,87 83.82,99.69 48.9,99.69 48.9,106.05 83.82,106.05
  pour Bottom (isolate 0.254): 83.82,121.28 83.82,106.05 48.9,106.05 48.9,99.69 83.82,99.69 83.82,65.41 130.18,65.41 130.18,0 0.64,0 0.64,121.28
I2C_SCL
  Bottom 1.016: JP24.14 JP25.14
I2C_SDA
  Bottom 1.016: JP25.13 JP24.13
JTAG_TCK
  Bottom 1.016: JP25.11 JP24.11
JTAG_TDI
  Bottom 1.016: JP24.10 JP25.10
JTAG_TDO
  Bottom 1.016: JP25.9 JP24.9
JTAG_TMS
  Bottom 1.016: JP24.8 JP25.8
N$1
  Top 0.61: R15.2 110.17,90.49
  Top 1.016: 110.17,90.49 111.76,88.9 120.65,88.9 121.92,90.17 121.92,102.23 120.94,103.22 S1.7
N$2
  Top 0.61: U5.3 107.31,92.71 107.95,92.08 107.95,91.12 R15.1
N$3  (via drill 0.5)
  Top 0.61: U5.2 106.05,91.44 106.68,90.81 106.68,86.04 R14.1 v107,82.87 | R12.2 93.66,83.5 v94.61,82.55
  Bottom 0.61: v94.61,82.55 106.68,82.55 v107,82.87
N$4
  Top 0.61: 111.53,107.22 R5.2
  Top 1.016: 111.53,107.22 S1.2 S1.6
N$5
  Top 0.61: R13.1 R14.2
N$6
  Top 1.016: S1.4 105.79,101.22 104.78,102.23 R4.I1
N$7
  Top 0.61: R21.1 R13.2 98.11,87.63 100.33,89.85 100.33,92.08 99.69,92.71 U5.6
N$8
  Top 0.61: 100.01,72.7 JP20.1
  Top 1.016: 91.44,76.2 JP19.P$1 92.71,72.39 JP20.1 | R21.2 100.01,72.7
  pour Top (isolate 0.406): 88.9,74.3 93.98,74.3 93.98,78.74 88.9,78.74
N$9
  Top 0.61: 75.56,111.12 JP8.P$1
  Top 1.016: JP7.1 67.31,110.49 67.94,111.12 75.56,111.12
  pour Top (isolate 0.406): 73.03,109.22 78.11,109.22 78.11,113.67 73.03,113.67
N$10
  Top 0.61: 56.52,111.12 JP6.P$1
  Top 1.016: JP7.2 64.77,110.49 64.14,111.12 56.52,111.12
  pour Top (isolate 0.406): 53.98,109.22 59.05,109.22 59.05,113.67 53.98,113.67
N$11
  Top 0.61: D4.A R18.1
N$12
  Top 0.406: U4.3 U4.4 96.31,104.88 R2.1
N$13
  Top 0.406: U4.1 98.76,101.58 99.38,100.97 R3.2
  Top 0.61: R3.2 R1.1
N$14
  Top 0.61: Q3.1 13.46,38.86 13.97,39.37 13.97,41.77 S3.6
N$15
  Top 0.406: U6.3 112.73,90.79 112.08,91.44 112.08,94.93 112.39,95.25 R16.1
N$16
  Top 0.61: R17.1 D3.A
N$17  (via drill 0.5)
  Top 0.406: v116.84,91.44 115.88,91.44 | 115.88,91.44 U6.5 | 115.88,91.44 115.57,91.44 115.57,91.14 U6.4
  Bottom 0.61: S2.6 119.47,84.36 118.75,85.09 118.75,90.17 117.47,91.44 v116.84,91.44
N$18
  Top 0.61: D2.A 115.73,95.73 R16.2
N$19
  Top 0.61: D1.A R9.1
N$20
  Top 0.61: JP18.+ 81.28,67.94 82.55,66.67 121.28,66.67 122.56,67.94 122.56,79.38 121.57,80.36 S2.7 S2.3
N$21
  Top 0.61: S3.5 12.06,44.45 11.43,45.09 11.43,46.99 10.67,47.75 Q2.1
N$22
  Top 1.016: R6.1 R5.1 108.91,107.95 | JP10.P$1 111.12,113.67 110.49,113.03 110.49,111.12 108.91,109.54 108.91,107.95 | JP13.2 64.77,101.6 65.41,100.97 87.31,100.97 88.58,102.23 88.58,106.68 89.85,107.95 104.78,107.95 | 104.78,107.95 108.91,107.95 | R4.I2 104.78,107.95
  pour Top (isolate 0.406): 108.58,109.22 113.67,109.22 113.67,113.67 108.58,113.67
N$23
  Top 0.61: Q1.1 13.21,56.64 13.97,55.88 13.97,47.13 S3.4
N$24
  Top 0.61: R22.1 D5.A
N$25
  Top 1.016: S1.8 120.14,100.45 119.38,99.69 104.78,99.69 103.38,101.09 R4.V1
N$27
  Bottom 1.016: JP22.6 JP23.6
N$28
  Bottom 1.016: JP22.7 JP23.7
N$29
  Bottom 1.016: JP22.8 JP23.8
N$30
  Bottom 1.016: JP22.9 JP23.9
N$31
  Bottom 1.016: JP22.10 JP23.10
N$32
  Bottom 1.016: JP22.11 JP23.11
N$33
  Top 0.61: Q1.3 8.25,54.93 R23.1
N$37
  Bottom 1.016: JP23.16 JP22.16
N$38
  Bottom 1.016: JP22.17 JP23.17
N$42
  Bottom 1.016: JP23.21 JP22.21
N$43
  Bottom 1.016: JP22.22 JP23.22
N$44
  Bottom 1.016: JP23.23 JP22.23
N$45
  Top 0.61: D6.C 5.71,57.15 6.67,56.2 R23.2
N$46
  Top 0.61: D7.C 5.71,48.26 6.67,47.31 R24.2
N$47
  Top 0.61: D8.C 5.71,39.37 6.67,38.42 R25.2
N$49
  Top 0.61: Q2.3 8.25,46.04 R24.1
N$50
  Top 0.61: Q3.3 8.25,37.15 R25.1
N$51
  Top 0.305: U2.7 34.16,101.73 34.92,100.97 34.92,97.47 35.56,96.84 C8.1
N$52
  Top 0.305: JP27.VBUS 60.95,11.12 60.01,12.06 60.01,13.34 C16.1
  Top 0.406: L1.2 59.74,13.07 60.01,13.34
N$53
  Top 0.61: R28.1 C15.1 R29.1
N$54
  Top 0.61: U7.4 56.52,26.67 53.02,23.18 R28.2
N$55
  Top 0.61: Y1.1 54.33,31.39 54.61,31.11 54.61,29.84 55.24,29.21 U7.2
N$56
  Bottom 1.016: JP25.5 JP24.5
N$57
  Bottom 1.016: JP24.6 JP25.6
N$58
  Bottom 1.016: JP25.7 JP24.7
N$64
  Top 0.61: U7.17 69.22,26.67 70.81,25.08 C14.1
N$65
  Top 0.61: U7.3 55.24,27.94 54.61,27.3 54.61,26.67 54.33,26.39 Y1.3
N$66
  Top 0.406: JP25.15 96.52,25.4 97.79,26.67 104.78,26.67 106.05,25.4 S7.8
  Bottom 1.016: JP25.15 JP24.15
N$67
  Top 0.406: JP25.16 96.52,22.86 97.79,24.13 104.78,24.13 106.05,22.86 S7.7
  Bottom 1.016: JP24.16 JP25.16
N$68
  Top 0.406: JP25.17 96.52,20.32 97.79,21.59 104.78,21.59 106.05,20.32 S7.6
  Bottom 1.016: JP25.17 JP24.17
N$69
  Top 0.406: JP25.18 96.52,17.78 97.79,19.05 105.41,19.05 106.68,17.78 S7.5
  Bottom 1.016: JP24.18 JP25.18
N$70
  Bottom 1.016: JP24.19 JP25.19
N$71
  Top 0.61: U7.19 68.58,29.21 70.48,31.11 R26.1
N$72
  Top 0.61: U7.18 R27.1
N$73
  Top 0.254: U2.3 29.21,102.23
  Top 0.305: 29.21,102.23 28.57,101.6 28.57,96.84 R10.2
  Top 0.61: R10.2 R11.1
N$76
  Top 0.305: U1.7 15.11,101.73 15.88,100.97 15.88,97.79 16.83,96.84 C6.1
N$77
  Top 0.254: U1.3 10.16,102.23
  Top 0.305: 10.16,102.23 9.53,101.6 9.53,96.84 R7.2
  Top 0.406: R7.2 R8.1
N$78
  Top 0.305: U3.7 39.87,89.67 40.64,88.9 40.64,85.09 41.27,84.45 42.23,84.45 C12.1
N$80
  Top 0.254: U3.3 33.66,90.17
  Top 0.305: 33.66,90.17 33.02,89.53 33.02,84.77 R19.2
  Top 0.406: R19.2 R20.1
SPI_SCK
  Bottom 1.016: JP24.3 JP25.3
SPI_SDI
  Bottom 1.016: JP25.1 JP24.1
SPI_SDO
  Bottom 1.016: JP24.2 JP25.2
UART1_RX  (via drill 0.5)
  Top 0.305: S7.1 97.79,25.4 96.52,24.13 v81.28,24.13
  Top 0.406: U7.10 59.05,19.05 v60.33,20.32
  Bottom 0.406: v60.33,20.32 68.58,20.32 69.85,21.59 71.12,21.59 74.3,24.13 v81.28,24.13
UART1_TX  (via drill 0.5)
  Top 0.305: S7.2 97.79,22.86 96.52,21.59 v81.28,21.59
  Top 0.406: U7.12 68.26,20.32 70.17,18.41 71.75,18.41 72.39,19.05 v72.39,20.95
  Bottom 0.406: v72.39,20.95 73.03,21.59 v81.28,21.59
UART2_RX
  Bottom 1.016: JP25.20 JP24.20
UART2_TX
  Bottom 1.016: JP24.21 JP25.21
USER_BTN1
  Top 0.61: S4.3 S4.4 16.22,27.59 26.04,17.78 JP22.18
  Bottom 1.016: JP22.18 JP23.18
USER_BTN2
  Top 0.61: JP22.19 26.04,15.24 21.93,19.34 S5.4 S5.3
  Bottom 1.016: JP23.19 JP22.19
USER_BTN3
  Top 0.61: JP22.20 26.04,12.7 24.42,11.09 S6.4 S6.3
  Bottom 1.016: JP22.20 JP23.20
USER_LED1
  Top 0.61: S3.3 26.04,46.99 26.67,46.35 26.67,31.11 27.3,30.48 JP22.13
  Bottom 1.016: JP23.13 JP22.13
USER_LED2
  Top 0.61: S3.2 24.77,44.45 25.4,43.81 25.4,28.57 26.04,27.94 JP22.14
  Bottom 1.016: JP22.14 JP23.14
USER_LED3
  Top 0.61: S3.1 22.71,26.18 23.5,25.4 JP22.15
  Bottom 1.016: JP22.15 JP23.15
V+  (via drill 0.5)
  Top 0.406: U4.5 92.08,101.58 91.79,101.58 C5.1
  Top 0.61: 92.08,101.58 92.39,101.27 R1.2 92.39,96.2 93.34,95.25 93.34,91.44 | 94.61,91.44 U5.7 95.89,91.44 | 94.61,91.44 93.34,91.44 | 93.34,91.44 91.71,91.44 C10.1 | S2.4 115.95,78.36 114.94,79.38 114.94,83.19 116.11,84.36 S2.2 | U5.1 103.4,88.16 v102.87,87.63 | v94.61,88.27 94.61,91.44
  Bottom 0.61: S2.2 116.75,84.45 103.5,84.45 102.87,85.09 v102.87,87.63 95.25,87.63 v94.61,88.27
V-  (via drill 0.5)
  Top 0.406: C5.2 91.81,102.87 92.71,102.87 93.34,102.23 U4.2 100.97,102.23 101.6,101.6 101.6,98.75 R3.1 | U6.2 113.98,91.44 114.3,91.76 v114.3,93.03 114.62,93.34 119.38,93.34 D2.C | C11.1 108.31,94.25 v109.54,93.03
  Top 0.61: C11.1 107.68,93.98 U5.4 102.23,93.98 101.28,94.94 R3.1 | JP18.- 73.66,74.3 78.11,78.74 86.36,78.74 87.63,80.01 87.63,93.98 90.17,95.89 90.17,102.87 90.81,103.5 91.81,103.5 C5.2
  Bottom 0.406: v109.54,93.03 v114.3,93.03
V_EXT
  Top 0.61: JP3.P$1 25.4,113.03
  Top 1.016: JP16.1 JP16.2 JP16.3 JP16.4 | JP4.1 33.66,110.49 33.02,111.12 26.67,111.12 25.4,112.39 JP3.P$1
  Bottom 1.016: JP16.1 69.85,98.42 69.22,99.06 50.16,99.06 48.9,100.33 48.9,109.86 47.62,111.12 26.67,111.12 25.4,112.39 JP3.P$1
  pour Top (isolate 0.406): 22.86,113.67 27.94,113.67 27.94,109.22 22.86,109.22
VGND  (via drill 0.5)
  Top 0.61: C10.2 89.9,93.71 89.53,93.34 89.53,86.36 90.17,85.72 R12.1
  Top 1.016: 99.06,106.68 99.06,105.73 R2.2
  other vias: 101.6,113.03 92.08,105.41 113.67,105.41 96.52,96.52 104.14,97.16 87,97.16 85.72,85.09 87,74.93 91.44,81.28 110.49,81.28 118.11,74.93 118.11,68.58 56.52,102.87 52.7,102.87 104.78,76.83 97.16,76.83 100.97,68.58 127,68.58 127,74.93 127,98.42 127,84.45 127,90.17 105.41,116.2 87,118.11 87,113.03 118.75,118.11 118.75,113.67 127,102.87 127,111.76 111.12,97.16 106.68,103.5 97.16,99.69 110.49,87 100.97,104.78
  pour Top (isolate 0.254, rank 2): 50.16,85.72 85.09,85.72 85.09,100.97 50.16,100.97 50.16,104.78 85.09,104.78 85.09,121.92 130.18,121.92 130.18,66.67 50.16,66.67
  pour Bottom (isolate 0.254): 85.09,121.92 85.09,104.78 50.16,104.78 50.16,100.97 85.09,100.97 85.09,66.67 130.18,66.67 130.18,121.92
VUSB
  Top 0.305: U8.5 66.25,14.71 C17.1
  Top 0.61: R29.2 53.02,13.65 54.29,14.92 56.46,14.92 L1.1 56.52,16.51 57.15,17.14 60.96,17.14 62.23,18.41 | C13.1 57.47,30.54 U7.1 60.96,30.48 62.23,29.21 62.23,18.41 | 62.23,18.41 64.77,18.41 66.04,17.14 C17.1

### Text on the board
tPlace: Current / Input | I+ | I- | + V_EXT - | + | - | I+ | I- | +12V | 1mV/nA / / 1mV/µA / / 1mV/mA | +12V | 5V | BATT / OK | 3.3V | V_REG | V_EXT | CPU_BRD | +12V | 1.8V | 5V | CR2032 | 3.3V | OFF / / ON-LED / / ON | GND | V+ | V- | 1.8V | µCurrent | Power / Supply | Voltage / Output | Pin 1 | +12V | 5V | SPI_SDI | LED1 | SPI_SDO | 3.3V | HS.R / DBS / 4/2013 / Rev.01 | 1.8V | SPI_SCK | !SPI_SS | GND | LED2 | CPU Board | JTAG_TMS | LED3 | JTAG_TDO | JTAG_TDI | JTAG_TCK | GND | GND | I2C_SDA | BUTTON1 | I2C_SCL | UART1_RX | UART1_TX | BUTTON2 | !UART1_RTS | !UART1_CTS | BUTTON3 | UART2_RX | UART2_TX | !UART2_RTS | USB<->UART | !UART2_CTS | GND | GND